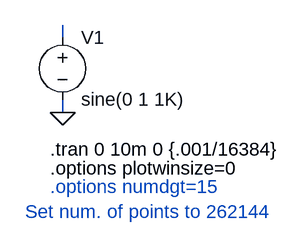
[diagram p0: schematic single.asc]
single.asc, the LTspice schematic file:
Version 4
SHEET 1 880 680
WIRE 128 240 128 224
WIRE 128 336 128 320
FLAG 128 336 0
SYMBOL voltage 128 224 R0
SYMATTR InstName V1
SYMATTR Value sine(0 1 1K)
TEXT 112 384 Left 0 !.tran 0 10m 0 {.001/16384}
TEXT 112 408 Left 0 !.options plotwinsize=0
TEXT 112 432 Left 0 ;.options numdgt=15
TEXT 80 464 Left 0 ;Set num. of points to 262144

The netlist it stands for:
* single.asc
V1 N001 0 sine(0 1 1K)
.tran 0 10m 0 {.001/16384}
.options plotwinsize=0
* .options numdgt=15
* Set num. of points to 262144
.backanno
.end